# Altium schematic sheet Power_Supply.SchDoc: Power_Supply
size A4; SheetNumber: 2; SheetTotal: 5
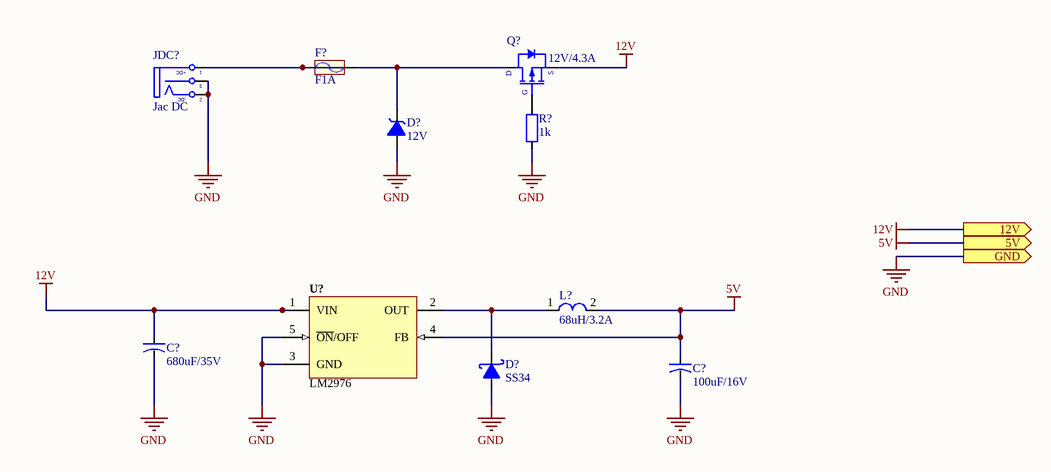
[diagram p0: Power_Supply.SchDoc]

## Parts
(Parts that share a designator on the sheet are numbered #1, #2 ... from top to bottom, then left to right.)
C?#1  680uF/35V  [CAP-ALU-SMD-H]
C?#2  100uF/16V  [CAP-ALU-SMD-6.3x7.7x2.2]
D?#1  12V  [SMA]
D?#2  SS34  [SMA]
F?  F1A  [RES-SMD-1812]
JDC?  Jac DC  [DC-IN]
L?  68uH/3.2A  [L-SMD-M-12x10]
Q?  12V/4.3A  [SOT23]
R?  1k  [RES-SMD-0805]
U?  LM2976  [TO263-5]

## Ports
5V (out), 12V (out), GND (out)

## Nets
5V: C?#2.1 L?.2 U?.4(FB) ; port 5V
12V: C?#1.1 Q?.3(S) U?.1(VIN) ; port 12V
GND: C?#1.2 C?#2.2 D?#1.1(A) D?#2.1(A) JDC?.2(TN) JDC?.3(S) R?.1 U?.3(GND) U?.5(~{ON}/OFF) ; port GND
NetD?#1_2: D?#1.2(K) F?.2 Q?.2(D)
NetD?#2_2: D?#2.2(K) L?.1 U?.2(OUT)
NetF?_1: F?.1 JDC?.1(T)
NetQ?_1: Q?.1(G) R?.2

## Notes on the sheet
- Document Title:
- ĐH BKHN
- Project Name:
- Size:
- A4
- Reviewer:
- Designer:
- Nguyen Ba Hoang
- Revision:
- 1 Dai Co Viet Street
- Bach Khoa, Hai Ba Trung
- Ha Noi
- File:
- Sheet:
- of
- Date:
- (in symbol DCIN) +DC; -DC

## Library data of the parts
C?#1 C?#2 = CAP-ALU-SMD: Polarized Capacitor (Axial)
  C?#1: Supplier: Thegioiic; Supplier Part Num: Tụ Nhôm SMD 680uF 35V 12.5x13.5mm
  C?#2: Published: 8-Jun-2000; LatestRevisionDate: 17-Jul-2002; LatestRevisionNote: Re-released for DXP Platform.; PackageReference: POLAR0.8; Publisher: Altium Limited
D?#1 = DZ: Diode TVS; Supplier: Thegioiic; Supplier Part Num: SMAJ12A
D?#2 = 1N5822: Schottky Rectifiers; Supplier: Thegioiic; Supplier Part Num: SS34 SMA Diode Schottky 3A
F? = Fuse: Supplier: Thegioiic; Supplier Part Num: MF-MSMF250/16 Cầu Chì Tự Phục Hồi 1812 16V 2.5A
JDC? = DCIN: Jac DC input; Available: *
L? = L-SMD-1: ComponentLink1Description: Manufacturer; ComponentLink1URL: http://www.we-online.de; ComponentLink2Description: Datasheet; ComponentLink2URL: http://katalog.we-online.de/pbs/datasheet/78477010.pdf; Supplier: Thegioiic; Supplier Part Num: Cuộn Cảm Dán SMD 1280-680 68uH 3.2A
Q? = IRLML6401TRPBF: Supplier: Thegioiic; Supplier Part Num: IRLML6401TRPBF
R? = Resistor - SMD: Resistor; Manufacturer: Generic Components; Class: Passive; Published: 08/06/2000; Publisher: Altium Hobart Technology Centre
U? = LM2596: Supplier: Thegioiic; Supplier Part Num: LM2596S-5.0 IC Điều Chỉnh Giảm Áp 5V 3A TO-263-5